# EAGLE schematic schematic (EAGLE 9.6.2)
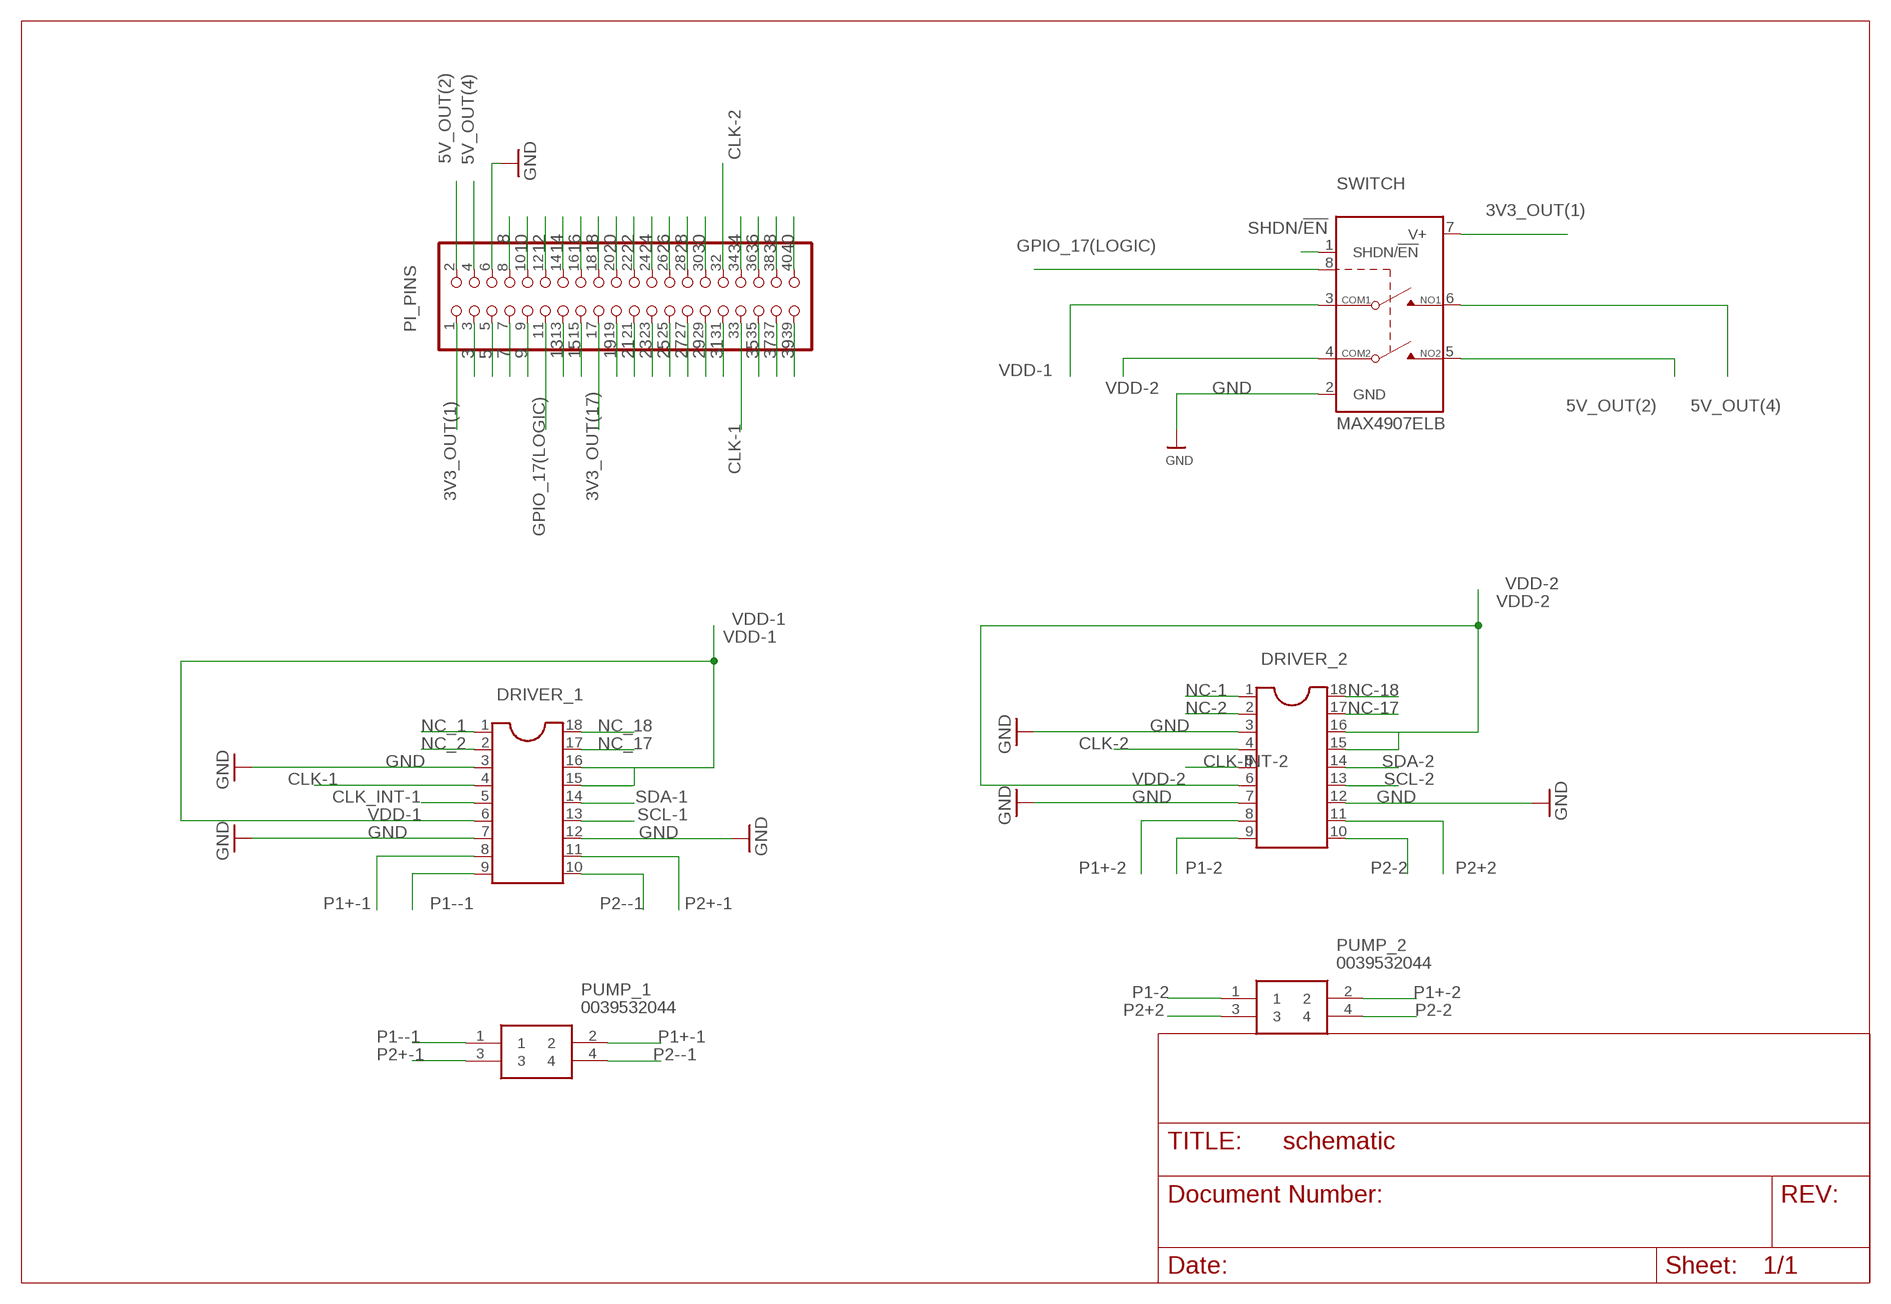
[diagram p0: schematic, sheet 1]

## Parts
DRIVER_1  DIL18  [DIL18]
DRIVER_2  DIL18  [DIL18]
PI_PINS  PINHD-2X20  [2X20]
PUMP_1  0039532044  [0039532044]
PUMP_2  0039532044  [0039532044]
SWITCH  MAX4907ELB  [UDFN8]

## Nets
3: PI_PINS.3
3V3_OUT(1): PI_PINS.1 SWITCH.7(V+)
3V3_OUT(17): PI_PINS.17
5: PI_PINS.5
5V_OUT(2): PI_PINS.2 SWITCH.5(NO2)
5V_OUT(4): PI_PINS.4 SWITCH.6(NO1)
7: PI_PINS.7
8: PI_PINS.8
9: PI_PINS.9
10: PI_PINS.10
12: PI_PINS.12
13: PI_PINS.13
14: PI_PINS.14
15: PI_PINS.15
16: PI_PINS.16
18: PI_PINS.18
19: PI_PINS.19
20: PI_PINS.20
21: PI_PINS.21
22: PI_PINS.22
23: PI_PINS.23
24: PI_PINS.24
25: PI_PINS.25
26: PI_PINS.26
27: PI_PINS.27
28: PI_PINS.28
29: PI_PINS.29
30: PI_PINS.30
31: PI_PINS.31
34: PI_PINS.34
35: PI_PINS.35
36: PI_PINS.36
37: PI_PINS.37
38: PI_PINS.38
39: PI_PINS.39
40: PI_PINS.40
CLK-1: DRIVER_1.4 PI_PINS.33
CLK-2: DRIVER_2.4 PI_PINS.32
CLK-INT-2: DRIVER_2.5
CLK_INT-1: DRIVER_1.5
GND: DRIVER_1.3 DRIVER_1.7 DRIVER_1.12 DRIVER_2.3 DRIVER_2.7 DRIVER_2.12 PI_PINS.6 SWITCH.2(GND)
GPIO_17(LOGIC): PI_PINS.11 SWITCH.8(IN)
NC-1: DRIVER_2.1
NC-2: DRIVER_2.2
NC-17: DRIVER_2.17
NC-18: DRIVER_2.18
NC_1: DRIVER_1.1
NC_2: DRIVER_1.2
NC_17: DRIVER_1.17
NC_18: DRIVER_1.18
P1+-1: DRIVER_1.8 PUMP_1.2
P1+-2: DRIVER_2.8 PUMP_2.2
P1-2: DRIVER_2.9 PUMP_2.1
P1--1: DRIVER_1.9 PUMP_1.1
P2+2: DRIVER_2.11 PUMP_2.3
P2+-1: DRIVER_1.11 PUMP_1.3
P2-2: DRIVER_2.10 PUMP_2.4
P2--1: DRIVER_1.10 PUMP_1.4
SCL-1: DRIVER_1.13
SCL-2: DRIVER_2.13
SDA-1: DRIVER_1.14
SDA-2: DRIVER_2.14
SHDN/!EN: SWITCH.1(SHDN/!EN)
VDD-1: DRIVER_1.6 DRIVER_1.15 DRIVER_1.16 SWITCH.3(COM1)
VDD-2: DRIVER_2.6 DRIVER_2.15 DRIVER_2.16 SWITCH.4(COM2)

## Library data of the parts
DRIVER_1 DRIVER_2 = ic-package:DIL18: Dual In Line / Socket
PI_PINS = pinhead:PINHD-2X20: PIN HEADER
PUMP_1 PUMP_2 = 0039532044:0039532044: Conn FPC Connector SKT 4 POS 1.25mm Solder RA Thru-Hole Tray Source: Datasheet <https://www.molex.com/pdm_docs/sd/039532044_sd.pdf>; ARROW_PART_NUMBER: 0039532044; ARROW_PRICE-STOCK: https://www.arrow.com/en/products/0039532044/molex?region=europe; DESCRIPTION: Conn FPC Connector SKT 4 POS 1.25mm Solder RA Thru-Hole Tray; HEIGHT: 5.6mm; MANUFACTURER_NAME: Molex; MANUFACTURER_PART_NUMBER: 0039532044; MOUSER_PART_NUMBER: N/A; MOUSER_PRICE-STOCK: https://www.mouser.co.uk/ProductDetail/Molex/0039532044?qs=PBcRNPEHKsopUbhCVSpiQg%3D%3D
SWITCH = maxim:MAX4907: High-/Full-Speed USB 2.0 Switches Source: http://datasheets.maxim-ic.com/en/ds/MAX4906-MAX4907F.pdf; OC_FARNELL: unknown; OC_NEWARK: unknown